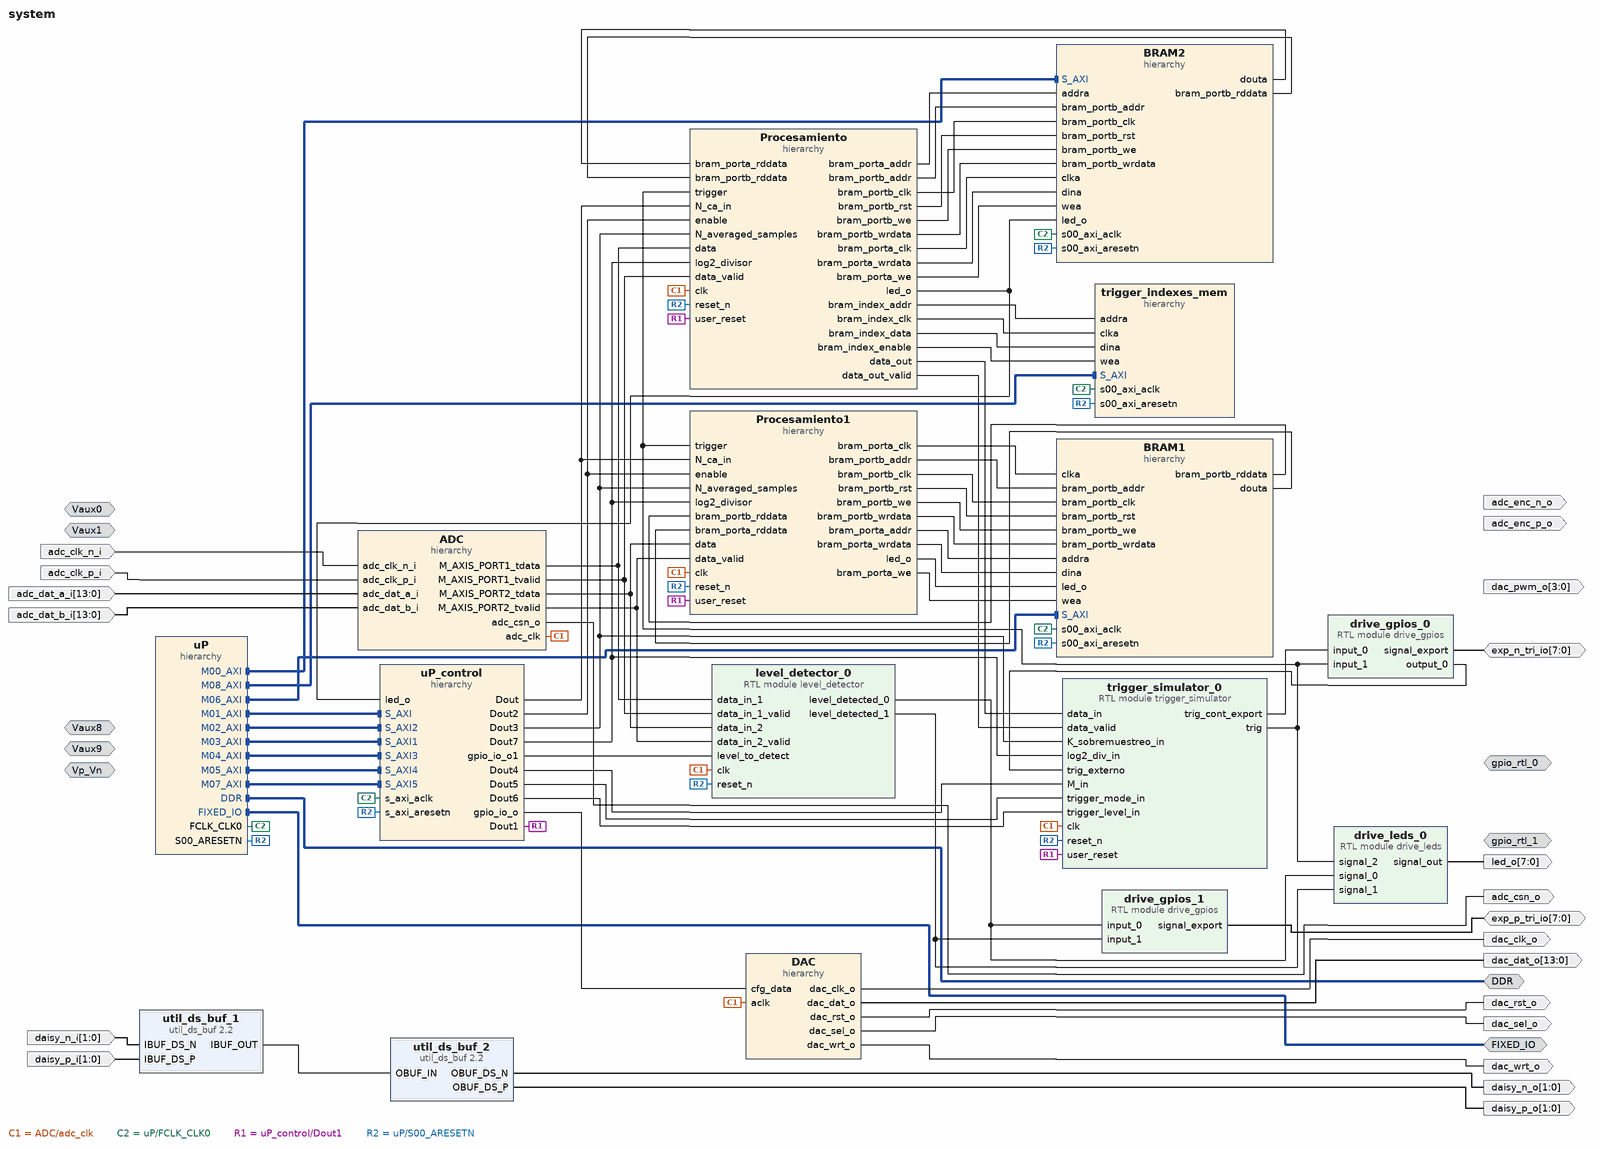
[diagram p0: block diagram of the top level]
# Vivado block design system, xc7z010clg400-1, Vivado 2022.2
create_bd_design system

create_bd_intf_port -mode Slave -vlnv xilinx.com:interface:diff_analog_io_rtl:1.0 Vp_Vn
create_bd_intf_port -mode Slave -vlnv xilinx.com:interface:diff_analog_io_rtl:1.0 Vaux0
create_bd_intf_port -mode Slave -vlnv xilinx.com:interface:diff_analog_io_rtl:1.0 Vaux1
create_bd_intf_port -mode Slave -vlnv xilinx.com:interface:diff_analog_io_rtl:1.0 Vaux9
create_bd_intf_port -mode Slave -vlnv xilinx.com:interface:diff_analog_io_rtl:1.0 Vaux8
create_bd_intf_port -mode Master -vlnv xilinx.com:interface:ddrx_rtl:1.0 DDR
create_bd_intf_port -mode Master -vlnv xilinx.com:display_processing_system7:fixedio_rtl:1.0 FIXED_IO
create_bd_intf_port -mode Master -vlnv xilinx.com:interface:gpio_rtl:1.0 gpio_rtl_0
create_bd_intf_port -mode Master -vlnv xilinx.com:interface:gpio_rtl:1.0 gpio_rtl_1
create_bd_port -dir I -from 13 -to 0 adc_dat_a_i
create_bd_port -dir I -from 13 -to 0 adc_dat_b_i
create_bd_port -dir I adc_clk_p_i
create_bd_port -dir I adc_clk_n_i
create_bd_port -dir O adc_enc_p_o
create_bd_port -dir O adc_enc_n_o
create_bd_port -dir O adc_csn_o
create_bd_port -dir O -from 13 -to 0 dac_dat_o
create_bd_port -dir O dac_clk_o
create_bd_port -dir O dac_rst_o
create_bd_port -dir O dac_sel_o
create_bd_port -dir O dac_wrt_o
create_bd_port -dir O -from 3 -to 0 dac_pwm_o
create_bd_port -dir IO -from 7 -to 0 exp_p_tri_io
create_bd_port -dir IO -from 7 -to 0 exp_n_tri_io
create_bd_port -dir O -from 1 -to 0 daisy_p_o
create_bd_port -dir O -from 1 -to 0 daisy_n_o
create_bd_port -dir I -from 1 -to 0 daisy_p_i
create_bd_port -dir I -from 1 -to 0 daisy_n_i
create_bd_port -dir O -from 7 -to 0 led_o

create_bd_cell -type ip -vlnv xilinx.com:ip:util_ds_buf:2.2 util_ds_buf_1
set_property -dict {CONFIG.C_SIZE 2} [get_bd_cells util_ds_buf_1]
create_bd_cell -type ip -vlnv xilinx.com:ip:util_ds_buf:2.2 util_ds_buf_2
set_property -dict {CONFIG.C_BUF_TYPE OBUFDS CONFIG.C_SIZE 2} [get_bd_cells util_ds_buf_2]
create_bd_cell -type hier DAC
create_bd_cell -type hier uP_control
create_bd_cell -type hier uP
create_bd_cell -type hier ADC
create_bd_cell -type hier Procesamiento
create_bd_cell -type hier Procesamiento1
create_bd_cell -type hier BRAM1
create_bd_cell -type hier BRAM2
create_bd_cell -type module -reference trigger_simulator trigger_simulator_0
create_bd_cell -type hier trigger_indexes_mem
create_bd_cell -type module -reference drive_gpios drive_gpios_1
create_bd_cell -type module -reference level_detector level_detector_0
create_bd_cell -type module -reference drive_leds drive_leds_0
create_bd_cell -type module -reference drive_gpios drive_gpios_0

# ---- hierarchy /DAC ----
current_bd_instance /DAC
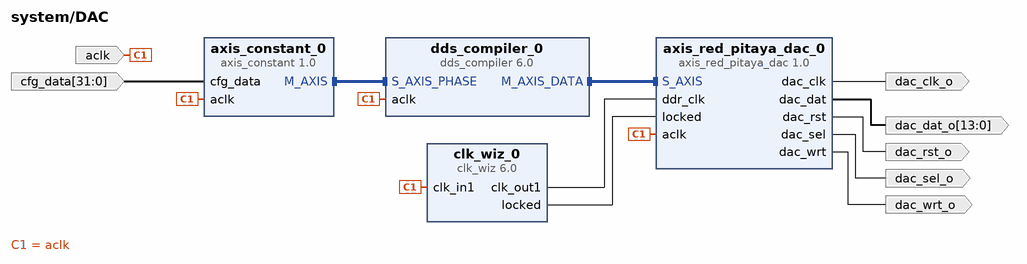
[diagram p1: block diagram inside /DAC]
create_bd_pin -dir I -type clk aclk
create_bd_pin -dir O -type clk dac_clk_o
create_bd_pin -dir O -type rst dac_rst_o
create_bd_pin -dir O dac_sel_o
create_bd_pin -dir O dac_wrt_o
create_bd_pin -dir O -from 13 -to 0 dac_dat_o
create_bd_pin -dir I -from 31 -to 0 cfg_data

create_bd_cell -type ip -vlnv pavel-demin:user:axis_red_pitaya_dac:1.0 axis_red_pitaya_dac_0
create_bd_cell -type ip -vlnv xilinx.com:ip:dds_compiler:6.0 dds_compiler_0
set_property -dict [list \
  CONFIG.Amplitude_Mode Unit_Circle \
  CONFIG.DATA_Has_TLAST Not_Required \
  CONFIG.DDS_Clock_Rate 125 \
  CONFIG.Frequency_Resolution 0.5 \
  CONFIG.Has_Phase_Out false \
  CONFIG.Latency 8 \
  CONFIG.M_DATA_Has_TUSER Not_Required \
  CONFIG.Negative_Cosine false \
  CONFIG.Noise_Shaping Auto \
  CONFIG.Output_Frequency1 0 \
  CONFIG.Output_Width 14 \
  CONFIG.PINC1 0 \
  CONFIG.Phase_Increment Streaming \
  CONFIG.Phase_Width 28 \
  CONFIG.S_PHASE_Has_TUSER Not_Required \
  CONFIG.Spurious_Free_Dynamic_Range 84 \
] [get_bd_cells dds_compiler_0]
create_bd_cell -type ip -vlnv xilinx.com:ip:clk_wiz:6.0 clk_wiz_0
set_property -dict [list \
  CONFIG.CLKIN1_JITTER_PS 80.0 \
  CONFIG.CLKOUT1_JITTER 104.759 \
  CONFIG.CLKOUT1_PHASE_ERROR 96.948 \
  CONFIG.CLKOUT1_REQUESTED_OUT_FREQ 250.000 \
  CONFIG.MMCM_CLKFBOUT_MULT_F 8.000 \
  CONFIG.MMCM_CLKIN1_PERIOD 8.000 \
  CONFIG.MMCM_CLKOUT0_DIVIDE_F 4.000 \
  CONFIG.PRIM_IN_FREQ 125.000 \
  CONFIG.USE_RESET false \
] [get_bd_cells clk_wiz_0]
create_bd_cell -type ip -vlnv pavel-demin:user:axis_constant:1.0 axis_constant_0

# ---- hierarchy /uP_control ----
current_bd_instance /uP_control
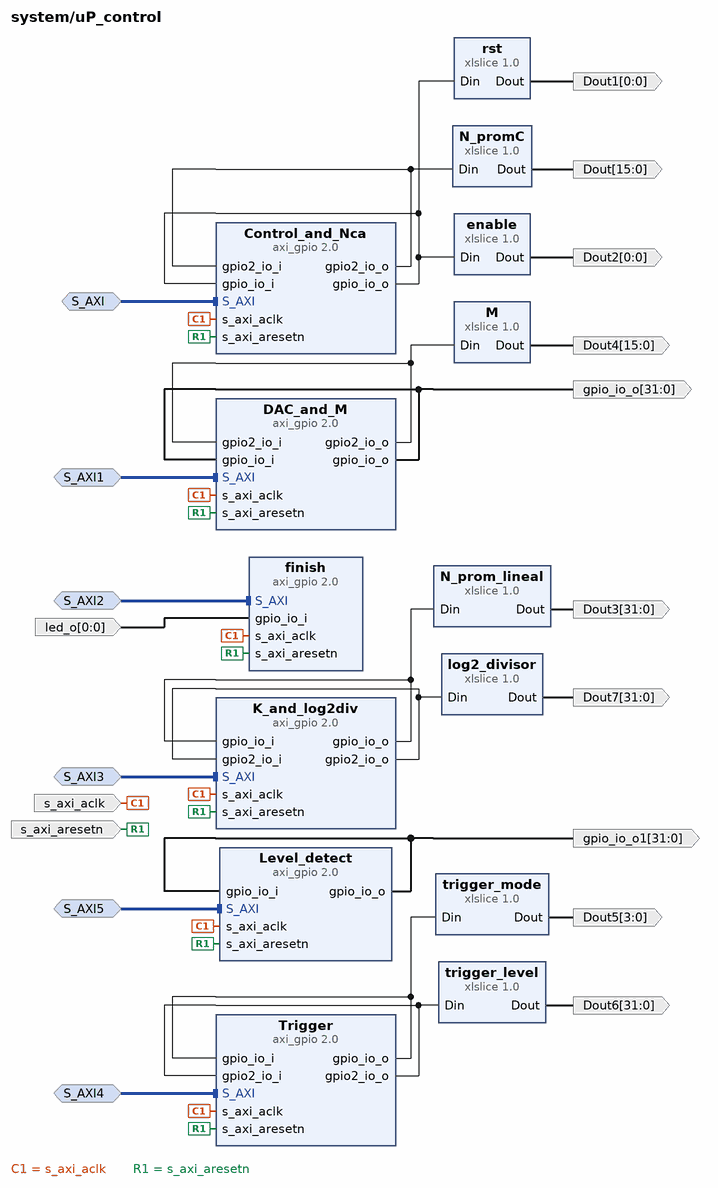
[diagram p2: block diagram inside /uP_control]
create_bd_intf_pin -mode Slave -vlnv xilinx.com:interface:aximm_rtl:1.0 S_AXI
create_bd_intf_pin -mode Slave -vlnv xilinx.com:interface:aximm_rtl:1.0 S_AXI2
create_bd_intf_pin -mode Slave -vlnv xilinx.com:interface:aximm_rtl:1.0 S_AXI3
create_bd_intf_pin -mode Slave -vlnv xilinx.com:interface:aximm_rtl:1.0 S_AXI1
create_bd_intf_pin -mode Slave -vlnv xilinx.com:interface:aximm_rtl:1.0 S_AXI4
create_bd_intf_pin -mode Slave -vlnv xilinx.com:interface:aximm_rtl:1.0 S_AXI5
create_bd_pin -dir O -from 15 -to 0 Dout
create_bd_pin -dir O -from 0 -to 0 Dout1
create_bd_pin -dir O -from 0 -to 0 Dout2
create_bd_pin -dir I -type clk s_axi_aclk
create_bd_pin -dir I -type rst s_axi_aresetn
create_bd_pin -dir I -from 0 -to 0 led_o
create_bd_pin -dir O -from 15 -to 0 Dout4
create_bd_pin -dir O -from 31 -to 0 Dout3
create_bd_pin -dir O -from 31 -to 0 gpio_io_o
create_bd_pin -dir O -from 3 -to 0 Dout5
create_bd_pin -dir O -from 31 -to 0 Dout6
create_bd_pin -dir O -from 31 -to 0 Dout7
create_bd_pin -dir O -from 31 -to 0 gpio_io_o1

create_bd_cell -type ip -vlnv xilinx.com:ip:xlslice:1.0 N_promC
set_property -dict {CONFIG.DIN_FROM 15} [get_bd_cells N_promC]
create_bd_cell -type ip -vlnv xilinx.com:ip:xlslice:1.0 rst
set_property -dict {CONFIG.DIN_FROM 1 CONFIG.DIN_TO 1} [get_bd_cells rst]
create_bd_cell -type ip -vlnv xilinx.com:ip:xlslice:1.0 enable
create_bd_cell -type ip -vlnv xilinx.com:ip:axi_gpio:2.0 Control_and_Nca
set_property -dict {CONFIG.C_ALL_INPUTS 0 CONFIG.C_ALL_OUTPUTS 0 CONFIG.C_IS_DUAL 1} [get_bd_cells Control_and_Nca]
create_bd_cell -type ip -vlnv xilinx.com:ip:axi_gpio:2.0 finish
set_property -dict {CONFIG.C_ALL_INPUTS 1 CONFIG.C_GPIO_WIDTH 1} [get_bd_cells finish]
create_bd_cell -type ip -vlnv xilinx.com:ip:xlslice:1.0 M
set_property -dict {CONFIG.DIN_FROM 15} [get_bd_cells M]
create_bd_cell -type ip -vlnv xilinx.com:ip:xlslice:1.0 N_prom_lineal
set_property -dict {CONFIG.DIN_FROM 31 CONFIG.DIN_TO 0 CONFIG.DOUT_WIDTH 32} [get_bd_cells N_prom_lineal]
create_bd_cell -type ip -vlnv xilinx.com:ip:axi_gpio:2.0 K_and_log2div
set_property -dict {CONFIG.C_ALL_INPUTS 0 CONFIG.C_ALL_OUTPUTS 0 CONFIG.C_IS_DUAL 1} [get_bd_cells K_and_log2div]
create_bd_cell -type ip -vlnv xilinx.com:ip:axi_gpio:2.0 DAC_and_M
set_property -dict {CONFIG.C_ALL_INPUTS 0 CONFIG.C_ALL_OUTPUTS 0 CONFIG.C_IS_DUAL 1} [get_bd_cells DAC_and_M]
create_bd_cell -type ip -vlnv xilinx.com:ip:axi_gpio:2.0 Trigger
set_property -dict {CONFIG.C_ALL_INPUTS 0 CONFIG.C_ALL_OUTPUTS 0 CONFIG.C_IS_DUAL 1} [get_bd_cells Trigger]
create_bd_cell -type ip -vlnv xilinx.com:ip:xlslice:1.0 trigger_mode
set_property -dict {CONFIG.DIN_FROM 3 CONFIG.DIN_WIDTH 32} [get_bd_cells trigger_mode]
create_bd_cell -type ip -vlnv xilinx.com:ip:xlslice:1.0 trigger_level
set_property -dict {CONFIG.DIN_FROM 31 CONFIG.DIN_TO 0 CONFIG.DIN_WIDTH 32} [get_bd_cells trigger_level]
create_bd_cell -type ip -vlnv xilinx.com:ip:xlslice:1.0 log2_divisor
set_property -dict {CONFIG.DIN_FROM 31 CONFIG.DIN_TO 0 CONFIG.DOUT_WIDTH 32} [get_bd_cells log2_divisor]
create_bd_cell -type ip -vlnv xilinx.com:ip:axi_gpio:2.0 Level_detect
set_property -dict {CONFIG.C_ALL_INPUTS 0 CONFIG.C_ALL_OUTPUTS 0 CONFIG.C_IS_DUAL 1} [get_bd_cells Level_detect]

# ---- hierarchy /uP ----
current_bd_instance /uP
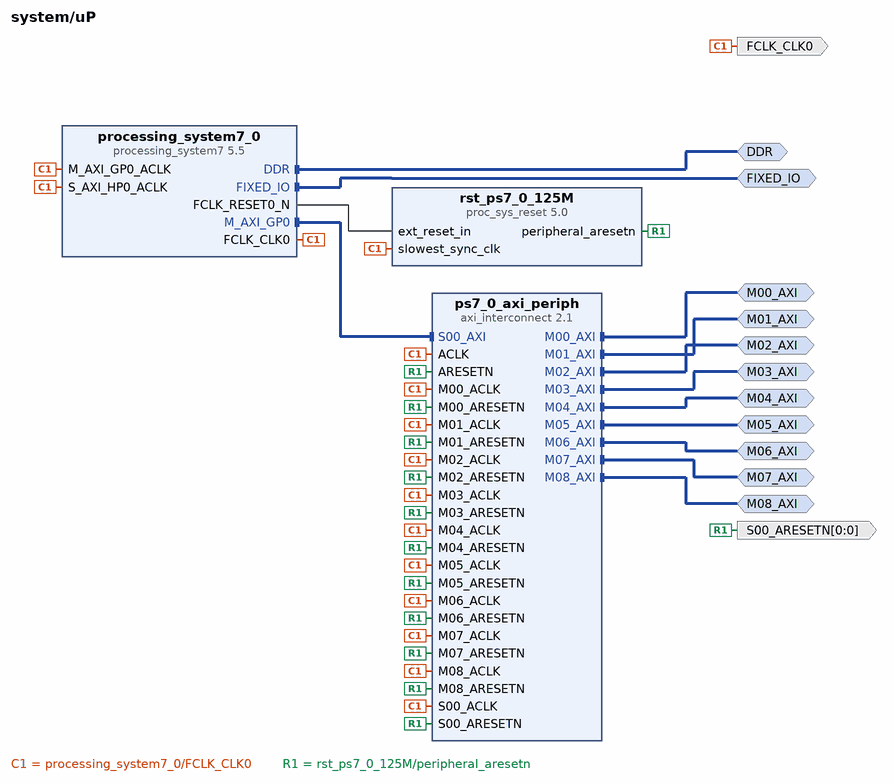
[diagram p3: block diagram inside /uP]
create_bd_intf_pin -mode Master -vlnv xilinx.com:interface:ddrx_rtl:1.0 DDR
create_bd_intf_pin -mode Master -vlnv xilinx.com:display_processing_system7:fixedio_rtl:1.0 FIXED_IO
create_bd_intf_pin -mode Master -vlnv xilinx.com:interface:aximm_rtl:1.0 M00_AXI
create_bd_intf_pin -mode Master -vlnv xilinx.com:interface:aximm_rtl:1.0 M01_AXI
create_bd_intf_pin -mode Master -vlnv xilinx.com:interface:aximm_rtl:1.0 M02_AXI
create_bd_intf_pin -mode Master -vlnv xilinx.com:interface:aximm_rtl:1.0 M03_AXI
create_bd_intf_pin -mode Master -vlnv xilinx.com:interface:aximm_rtl:1.0 M04_AXI
create_bd_intf_pin -mode Master -vlnv xilinx.com:interface:aximm_rtl:1.0 M05_AXI
create_bd_intf_pin -mode Master -vlnv xilinx.com:interface:aximm_rtl:1.0 M06_AXI
create_bd_intf_pin -mode Master -vlnv xilinx.com:interface:aximm_rtl:1.0 M07_AXI
create_bd_intf_pin -mode Master -vlnv xilinx.com:interface:aximm_rtl:1.0 M08_AXI
create_bd_pin -dir O -type clk FCLK_CLK0
create_bd_pin -dir O -from 0 -to 0 -type rst S00_ARESETN

create_bd_cell -type ip -vlnv xilinx.com:ip:processing_system7:5.5 processing_system7_0
set_property -dict [list \
  CONFIG.PCW_APU_PERIPHERAL_FREQMHZ 666.666666 \
  CONFIG.PCW_ENET0_ENET0_IO {MIO 16 .. 27} \
  CONFIG.PCW_ENET0_GRP_MDIO_ENABLE 1 \
  CONFIG.PCW_ENET0_GRP_MDIO_IO EMIO \
  CONFIG.PCW_ENET0_PERIPHERAL_ENABLE 1 \
  CONFIG.PCW_ENET0_RESET_ENABLE 0 \
  CONFIG.PCW_ENET_RESET_ENABLE 1 \
  CONFIG.PCW_ENET_RESET_SELECT {Share reset pin} \
  CONFIG.PCW_FPGA0_PERIPHERAL_FREQMHZ 125 \
  CONFIG.PCW_FPGA1_PERIPHERAL_FREQMHZ 250 \
  CONFIG.PCW_FPGA3_PERIPHERAL_FREQMHZ 200 \
  CONFIG.PCW_GPIO_MIO_GPIO_ENABLE 1 \
  CONFIG.PCW_GPIO_MIO_GPIO_IO MIO \
  CONFIG.PCW_GPIO_PERIPHERAL_ENABLE 1 \
  CONFIG.PCW_I2C0_GRP_INT_ENABLE 0 \
  CONFIG.PCW_I2C0_I2C0_IO {MIO 50 .. 51} \
  CONFIG.PCW_I2C0_PERIPHERAL_ENABLE 1 \
  CONFIG.PCW_I2C_PERIPHERAL_FREQMHZ 111.111115 \
  CONFIG.PCW_I2C_RESET_ENABLE 1 \
  CONFIG.PCW_I2C_RESET_SELECT {Share reset pin} \
  CONFIG.PCW_IMPORT_BOARD_PRESET cfg/red_pitaya.xml \
  CONFIG.PCW_PRESET_BANK1_VOLTAGE {LVCMOS 2.5V} \
  CONFIG.PCW_QSPI_GRP_SINGLE_SS_ENABLE 1 \
  CONFIG.PCW_QSPI_GRP_SINGLE_SS_IO {MIO 1 .. 6} \
  CONFIG.PCW_QSPI_PERIPHERAL_ENABLE 1 \
  CONFIG.PCW_QSPI_PERIPHERAL_FREQMHZ 125 \
  CONFIG.PCW_QSPI_QSPI_IO {MIO 1 .. 6} \
  CONFIG.PCW_SD0_GRP_CD_ENABLE 1 \
  CONFIG.PCW_SD0_GRP_CD_IO {MIO 46} \
  CONFIG.PCW_SD0_GRP_WP_ENABLE 1 \
  CONFIG.PCW_SD0_GRP_WP_IO {MIO 47} \
  CONFIG.PCW_SD0_PERIPHERAL_ENABLE 1 \
  CONFIG.PCW_SD0_SD0_IO {MIO 40 .. 45} \
  CONFIG.PCW_SDIO_PERIPHERAL_FREQMHZ 100 \
  CONFIG.PCW_SINGLE_QSPI_DATA_MODE x4 \
  CONFIG.PCW_SPI0_PERIPHERAL_ENABLE 1 \
  CONFIG.PCW_SPI0_SPI0_IO EMIO \
  CONFIG.PCW_SPI1_PERIPHERAL_ENABLE 1 \
  CONFIG.PCW_SPI1_SPI1_IO {MIO 10 .. 15} \
  CONFIG.PCW_TTC0_PERIPHERAL_ENABLE 1 \
  CONFIG.PCW_TTC0_TTC0_IO EMIO \
  CONFIG.PCW_UART0_PERIPHERAL_ENABLE 1 \
  CONFIG.PCW_UART0_UART0_IO {MIO 14 .. 15} \
  CONFIG.PCW_UART1_PERIPHERAL_ENABLE 1 \
  CONFIG.PCW_UART1_UART1_IO {MIO 8 .. 9} \
  CONFIG.PCW_UART_PERIPHERAL_FREQMHZ 100 \
  CONFIG.PCW_UIPARAM_DDR_BUS_WIDTH {16 Bit} \
  CONFIG.PCW_UIPARAM_DDR_FREQ_MHZ 533.333333 \
  CONFIG.PCW_UIPARAM_DDR_PARTNO {MT41J256M16 RE-125} \
  CONFIG.PCW_USB0_PERIPHERAL_ENABLE 1 \
  CONFIG.PCW_USB0_RESET_ENABLE 1 \
  CONFIG.PCW_USB0_RESET_IO {MIO 48} \
  CONFIG.PCW_USB0_USB0_IO {MIO 28 .. 39} \
  CONFIG.PCW_USB_RESET_ENABLE 1 \
  CONFIG.PCW_USB_RESET_SELECT {Share reset pin} \
  CONFIG.PCW_USE_S_AXI_HP0 1 \
] [get_bd_cells processing_system7_0]
# 429 more settings of processing_system7_0 are not shown: defaults, MIO pin electricals, DDR timing, and values the tool derives
create_bd_cell -type ip -vlnv xilinx.com:ip:proc_sys_reset:5.0 rst_ps7_0_125M
create_bd_cell -type ip -vlnv xilinx.com:ip:axi_interconnect:2.1 ps7_0_axi_periph
set_property -dict {CONFIG.NUM_MI 9} [get_bd_cells ps7_0_axi_periph]

# ---- hierarchy /ADC ----
current_bd_instance /ADC
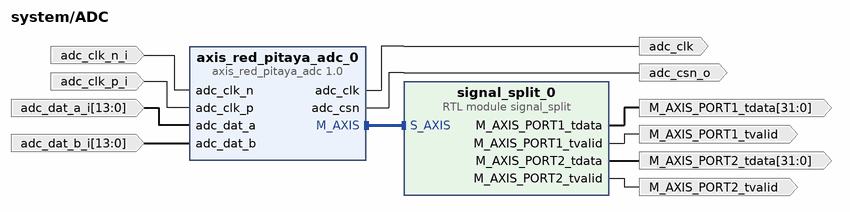
[diagram p4: block diagram inside /ADC]
create_bd_pin -dir O -from 31 -to 0 M_AXIS_PORT1_tdata
create_bd_pin -dir O M_AXIS_PORT1_tvalid
create_bd_pin -dir O -type clk adc_clk
create_bd_pin -dir O adc_csn_o
create_bd_pin -dir I adc_clk_p_i
create_bd_pin -dir I adc_clk_n_i
create_bd_pin -dir I -from 13 -to 0 adc_dat_a_i
create_bd_pin -dir I -from 13 -to 0 adc_dat_b_i
create_bd_pin -dir O -from 31 -to 0 M_AXIS_PORT2_tdata
create_bd_pin -dir O M_AXIS_PORT2_tvalid

create_bd_cell -type ip -vlnv pavel-demin:user:axis_red_pitaya_adc:1.0 axis_red_pitaya_adc_0
create_bd_cell -type module -reference signal_split signal_split_0

# ---- hierarchy /Procesamiento ----
current_bd_instance /Procesamiento
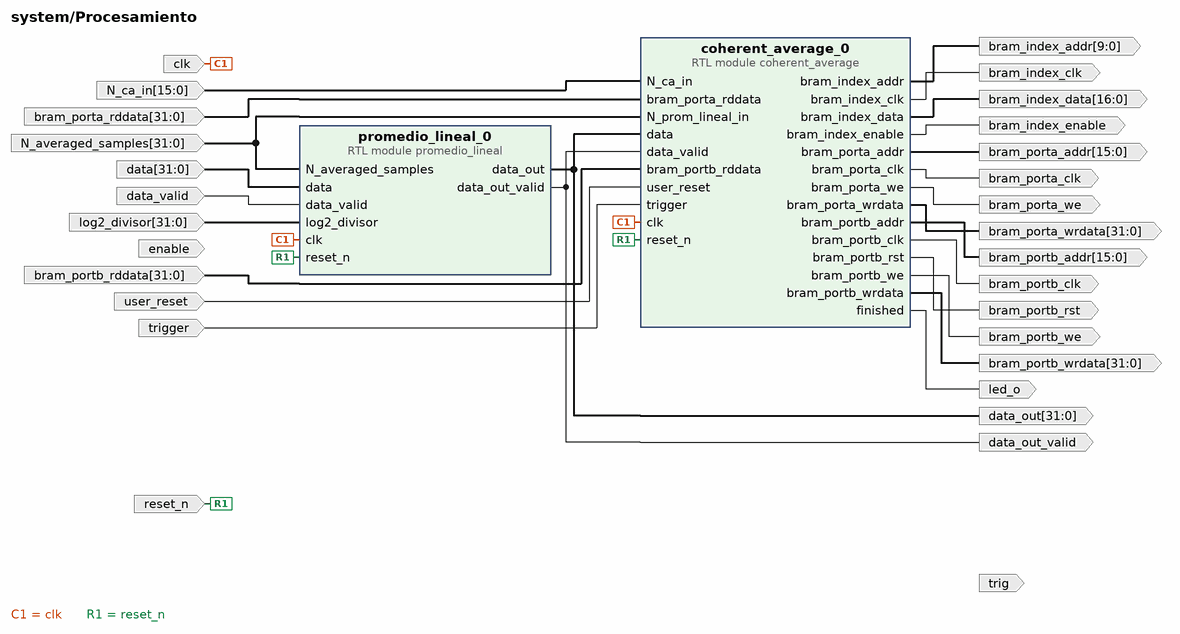
[diagram p5: block diagram inside /Procesamiento]
create_bd_pin -dir I -type clk clk
create_bd_pin -dir I -type rst reset_n
create_bd_pin -dir I -type rst user_reset
create_bd_pin -dir I enable
create_bd_pin -dir I -from 31 -to 0 N_averaged_samples
create_bd_pin -dir I data_valid
create_bd_pin -dir I -from 31 -to 0 data
create_bd_pin -dir O bram_portb_we
create_bd_pin -dir I -from 31 -to 0 bram_portb_rddata
create_bd_pin -dir O -from 31 -to 0 bram_portb_wrdata
create_bd_pin -dir O -from 15 -to 0 bram_portb_addr
create_bd_pin -dir O -type rst bram_portb_rst
create_bd_pin -dir O -type clk bram_portb_clk
create_bd_pin -dir O bram_porta_we
create_bd_pin -dir I -from 31 -to 0 bram_porta_rddata
create_bd_pin -dir O -from 31 -to 0 bram_porta_wrdata
create_bd_pin -dir O -from 15 -to 0 bram_porta_addr
create_bd_pin -dir O -type clk bram_porta_clk
create_bd_pin -dir I -from 15 -to 0 N_ca_in
create_bd_pin -dir O led_o
create_bd_pin -dir I -from 31 -to 0 log2_divisor
create_bd_pin -dir O trig
create_bd_pin -dir O data_out_valid
create_bd_pin -dir O -from 31 -to 0 data_out
create_bd_pin -dir I trigger
create_bd_pin -dir O -from 9 -to 0 bram_index_addr
create_bd_pin -dir O -type clk bram_index_clk
create_bd_pin -dir O bram_index_enable
create_bd_pin -dir O -from 16 -to 0 bram_index_data

create_bd_cell -type module -reference promedio_lineal promedio_lineal_0
create_bd_cell -type module -reference coherent_average coherent_average_0

# ---- hierarchy /Procesamiento1 ----
current_bd_instance /Procesamiento1
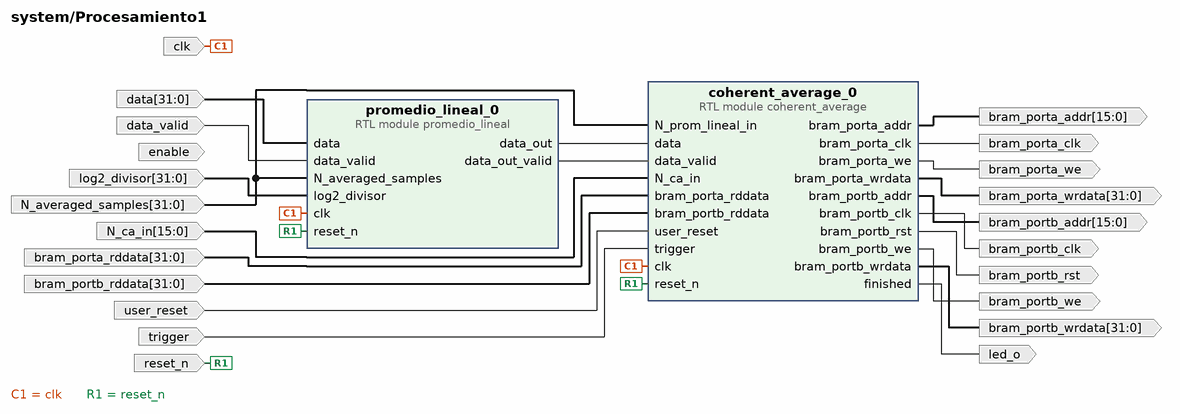
[diagram p6: block diagram inside /Procesamiento1]
create_bd_pin -dir I -type clk clk
create_bd_pin -dir I -type rst reset_n
create_bd_pin -dir I -type rst user_reset
create_bd_pin -dir I enable
create_bd_pin -dir I -from 31 -to 0 N_averaged_samples
create_bd_pin -dir I data_valid
create_bd_pin -dir I -from 31 -to 0 data
create_bd_pin -dir O bram_portb_we
create_bd_pin -dir I -from 31 -to 0 bram_portb_rddata
create_bd_pin -dir O -from 31 -to 0 bram_portb_wrdata
create_bd_pin -dir O -from 15 -to 0 bram_portb_addr
create_bd_pin -dir O -type rst bram_portb_rst
create_bd_pin -dir O -type clk bram_portb_clk
create_bd_pin -dir O bram_porta_we
create_bd_pin -dir I -from 31 -to 0 bram_porta_rddata
create_bd_pin -dir O -from 31 -to 0 bram_porta_wrdata
create_bd_pin -dir O -from 15 -to 0 bram_porta_addr
create_bd_pin -dir O -type clk bram_porta_clk
create_bd_pin -dir I -from 15 -to 0 N_ca_in
create_bd_pin -dir O led_o
create_bd_pin -dir I -from 31 -to 0 log2_divisor
create_bd_pin -dir I trigger

create_bd_cell -type module -reference promedio_lineal promedio_lineal_0
create_bd_cell -type module -reference coherent_average coherent_average_0

# ---- hierarchy /BRAM1 ----
current_bd_instance /BRAM1
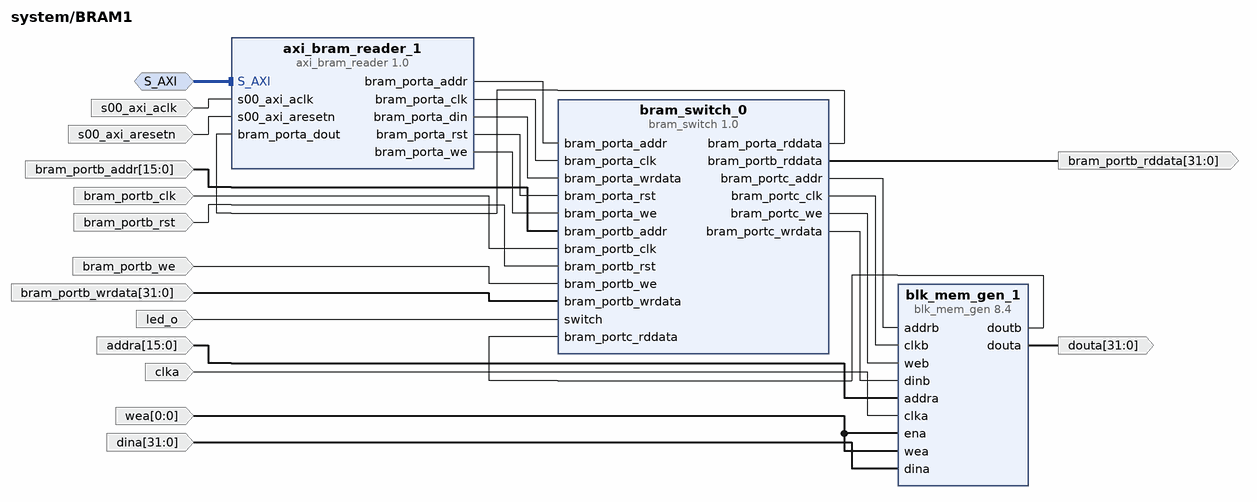
[diagram p7: block diagram inside /BRAM1]
create_bd_intf_pin -mode Slave -vlnv xilinx.com:interface:aximm_rtl:1.0 S_AXI
create_bd_pin -dir I -type clk s00_axi_aclk
create_bd_pin -dir I -type rst s00_axi_aresetn
create_bd_pin -dir I -type clk clka
create_bd_pin -dir I -from 0 -to 0 wea
create_bd_pin -dir I -from 15 -to 0 addra
create_bd_pin -dir I -from 31 -to 0 dina
create_bd_pin -dir O -from 31 -to 0 douta
create_bd_pin -dir I led_o
create_bd_pin -dir I -type clk bram_portb_clk
create_bd_pin -dir I -type rst bram_portb_rst
create_bd_pin -dir I -from 15 -to 0 bram_portb_addr
create_bd_pin -dir I -from 31 -to 0 bram_portb_wrdata
create_bd_pin -dir O -from 31 -to 0 bram_portb_rddata
create_bd_pin -dir I bram_portb_we

create_bd_cell -type ip -vlnv anton-potocnik:user:axi_bram_reader:1.0 axi_bram_reader_1
set_property -dict {CONFIG.BRAM_ADDR_WIDTH 16 CONFIG.C_S00_AXI_ADDR_WIDTH 18} [get_bd_cells axi_bram_reader_1]
create_bd_cell -type ip -vlnv xilinx.com:ip:blk_mem_gen:8.4 blk_mem_gen_1
set_property -dict [list \
  CONFIG.Algorithm Minimum_Area \
  CONFIG.Assume_Synchronous_Clk false \
  CONFIG.Enable_A Use_ENA_Pin \
  CONFIG.Enable_B Always_Enabled \
  CONFIG.Fill_Remaining_Memory_Locations true \
  CONFIG.Memory_Type True_Dual_Port_RAM \
  CONFIG.Operating_Mode_A READ_FIRST \
  CONFIG.Operating_Mode_B READ_FIRST \
  CONFIG.Register_PortA_Output_of_Memory_Primitives false \
  CONFIG.Register_PortB_Output_of_Memory_Primitives false \
  CONFIG.Use_Byte_Write_Enable false \
  CONFIG.Write_Depth_A 30720 \
  CONFIG.Write_Width_A 32 \
  CONFIG.use_bram_block Stand_Alone \
] [get_bd_cells blk_mem_gen_1]
create_bd_cell -type ip -vlnv xilinx.com:user:bram_switch:1.0 bram_switch_0

# ---- hierarchy /BRAM2 ----
current_bd_instance /BRAM2
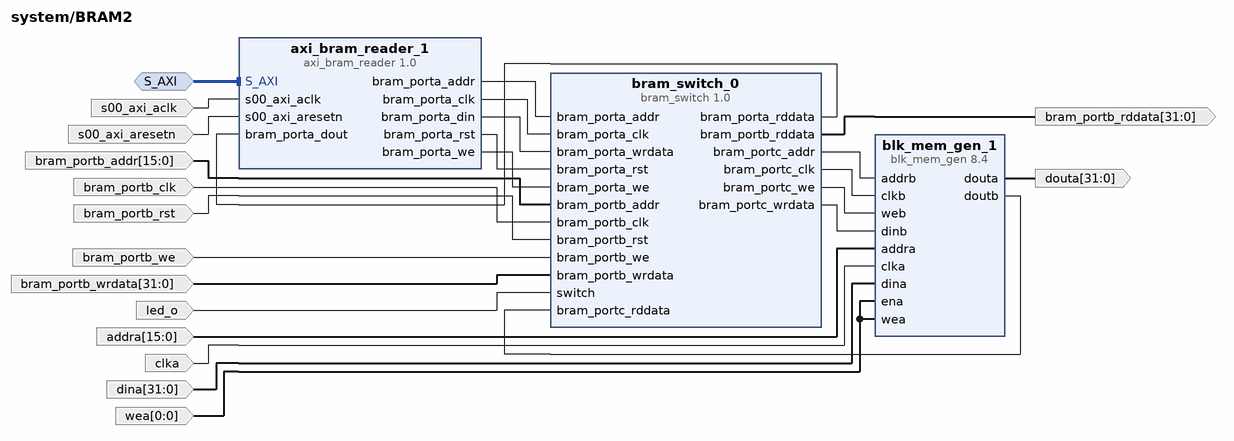
[diagram p8: block diagram inside /BRAM2]
create_bd_intf_pin -mode Slave -vlnv xilinx.com:interface:aximm_rtl:1.0 S_AXI
create_bd_pin -dir I -type clk s00_axi_aclk
create_bd_pin -dir I -type rst s00_axi_aresetn
create_bd_pin -dir I -type clk clka
create_bd_pin -dir I -from 0 -to 0 wea
create_bd_pin -dir I -from 15 -to 0 addra
create_bd_pin -dir I -from 31 -to 0 dina
create_bd_pin -dir O -from 31 -to 0 douta
create_bd_pin -dir I led_o
create_bd_pin -dir I -type clk bram_portb_clk
create_bd_pin -dir I -type rst bram_portb_rst
create_bd_pin -dir I -from 15 -to 0 bram_portb_addr
create_bd_pin -dir I -from 31 -to 0 bram_portb_wrdata
create_bd_pin -dir O -from 31 -to 0 bram_portb_rddata
create_bd_pin -dir I bram_portb_we

create_bd_cell -type ip -vlnv anton-potocnik:user:axi_bram_reader:1.0 axi_bram_reader_1
set_property -dict {CONFIG.BRAM_ADDR_WIDTH 16 CONFIG.C_S00_AXI_ADDR_WIDTH 18} [get_bd_cells axi_bram_reader_1]
create_bd_cell -type ip -vlnv xilinx.com:user:bram_switch:1.0 bram_switch_0
create_bd_cell -type ip -vlnv xilinx.com:ip:blk_mem_gen:8.4 blk_mem_gen_1
set_property -dict [list \
  CONFIG.Algorithm Minimum_Area \
  CONFIG.Assume_Synchronous_Clk false \
  CONFIG.Enable_A Use_ENA_Pin \
  CONFIG.Enable_B Always_Enabled \
  CONFIG.Fill_Remaining_Memory_Locations true \
  CONFIG.Memory_Type True_Dual_Port_RAM \
  CONFIG.Operating_Mode_A READ_FIRST \
  CONFIG.Operating_Mode_B READ_FIRST \
  CONFIG.Register_PortA_Output_of_Memory_Primitives false \
  CONFIG.Register_PortB_Output_of_Memory_Primitives false \
  CONFIG.Use_Byte_Write_Enable false \
  CONFIG.Write_Depth_A 30720 \
  CONFIG.Write_Width_A 32 \
  CONFIG.use_bram_block Stand_Alone \
] [get_bd_cells blk_mem_gen_1]

# ---- hierarchy /trigger_indexes_mem ----
current_bd_instance /trigger_indexes_mem
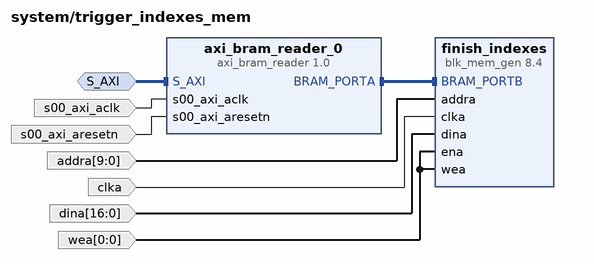
[diagram p9: block diagram inside /trigger_indexes_mem]
create_bd_intf_pin -mode Slave -vlnv xilinx.com:interface:aximm_rtl:1.0 S_AXI
create_bd_pin -dir I -type clk s00_axi_aclk
create_bd_pin -dir I -type rst s00_axi_aresetn
create_bd_pin -dir I -type clk clka
create_bd_pin -dir I -from 0 -to 0 wea
create_bd_pin -dir I -from 9 -to 0 addra
create_bd_pin -dir I -from 16 -to 0 dina

create_bd_cell -type ip -vlnv anton-potocnik:user:axi_bram_reader:1.0 axi_bram_reader_0
set_property -dict {CONFIG.BRAM_DATA_WIDTH 16 CONFIG.C_S00_AXI_DATA_WIDTH 32} [get_bd_cells axi_bram_reader_0]
create_bd_cell -type ip -vlnv xilinx.com:ip:blk_mem_gen:8.4 finish_indexes
set_property -dict [list \
  CONFIG.Memory_Type Simple_Dual_Port_RAM \
  CONFIG.Operating_Mode_A NO_CHANGE \
  CONFIG.Register_PortB_Output_of_Memory_Primitives true \
  CONFIG.Write_Depth_A 8192 \
  CONFIG.Write_Width_A 16 \
  CONFIG.Write_Width_B 16 \
  CONFIG.use_bram_block Stand_Alone \
] [get_bd_cells finish_indexes]

# ---- connections ----

current_bd_instance /DAC
connect_bd_intf_net [get_bd_intf_pins axis_constant_0/M_AXIS] [get_bd_intf_pins dds_compiler_0/S_AXIS_PHASE]
connect_bd_intf_net [get_bd_intf_pins dds_compiler_0/M_AXIS_DATA] [get_bd_intf_pins axis_red_pitaya_dac_0/S_AXIS]
connect_bd_net [get_bd_pins cfg_data] [get_bd_pins axis_constant_0/cfg_data]
connect_bd_net -net axis_red_pitaya_adc_0_adc_clk [get_bd_pins aclk] \
  [get_bd_pins axis_constant_0/aclk] [get_bd_pins clk_wiz_0/clk_in1] [get_bd_pins dds_compiler_0/aclk] \
  [get_bd_pins axis_red_pitaya_dac_0/aclk]
connect_bd_net [get_bd_pins axis_red_pitaya_dac_0/dac_clk] [get_bd_pins dac_clk_o]
connect_bd_net [get_bd_pins axis_red_pitaya_dac_0/dac_dat] [get_bd_pins dac_dat_o]
connect_bd_net [get_bd_pins axis_red_pitaya_dac_0/dac_rst] [get_bd_pins dac_rst_o]
connect_bd_net [get_bd_pins axis_red_pitaya_dac_0/dac_sel] [get_bd_pins dac_sel_o]
connect_bd_net [get_bd_pins axis_red_pitaya_dac_0/dac_wrt] [get_bd_pins dac_wrt_o]
connect_bd_net [get_bd_pins clk_wiz_0/clk_out1] [get_bd_pins axis_red_pitaya_dac_0/ddr_clk]
connect_bd_net [get_bd_pins clk_wiz_0/locked] [get_bd_pins axis_red_pitaya_dac_0/locked]

current_bd_instance /uP_control
connect_bd_intf_net -intf_net S_AXI3_1 [get_bd_intf_pins S_AXI3] [get_bd_intf_pins K_and_log2div/S_AXI]
connect_bd_intf_net -intf_net S_AXI4_1 [get_bd_intf_pins S_AXI4] [get_bd_intf_pins Trigger/S_AXI]
connect_bd_intf_net -intf_net S_AXI5_1 [get_bd_intf_pins S_AXI5] [get_bd_intf_pins Level_detect/S_AXI]
connect_bd_intf_net [get_bd_intf_pins S_AXI] [get_bd_intf_pins Control_and_Nca/S_AXI]
connect_bd_intf_net [get_bd_intf_pins S_AXI2] [get_bd_intf_pins finish/S_AXI]
connect_bd_intf_net [get_bd_intf_pins S_AXI1] [get_bd_intf_pins DAC_and_M/S_AXI]
connect_bd_net [get_bd_pins Level_detect/gpio_io_o] [get_bd_pins gpio_io_o1] [get_bd_pins Level_detect/gpio_io_i]
connect_bd_net [get_bd_pins M/Dout] [get_bd_pins Dout4]
connect_bd_net [get_bd_pins N_prom_lineal/Dout] [get_bd_pins Dout3]
connect_bd_net [get_bd_pins Control_and_Nca/gpio_io_o] [get_bd_pins Control_and_Nca/gpio_io_i] [get_bd_pins rst/Din] [get_bd_pins enable/Din]
connect_bd_net [get_bd_pins DAC_and_M/gpio_io_o] [get_bd_pins gpio_io_o] [get_bd_pins DAC_and_M/gpio_io_i]
connect_bd_net [get_bd_pins Control_and_Nca/gpio2_io_o] [get_bd_pins Control_and_Nca/gpio2_io_i] [get_bd_pins N_promC/Din]
connect_bd_net [get_bd_pins DAC_and_M/gpio2_io_o] [get_bd_pins M/Din] [get_bd_pins DAC_and_M/gpio2_io_i]
connect_bd_net [get_bd_pins K_and_log2div/gpio_io_o] [get_bd_pins K_and_log2div/gpio_io_i] [get_bd_pins N_prom_lineal/Din]
connect_bd_net [get_bd_pins Trigger/gpio2_io_o] [get_bd_pins Trigger/gpio2_io_i] [get_bd_pins trigger_level/Din]
connect_bd_net [get_bd_pins K_and_log2div/gpio2_io_o] [get_bd_pins K_and_log2div/gpio2_io_i] [get_bd_pins log2_divisor/Din]
connect_bd_net [get_bd_pins Trigger/gpio_io_o] [get_bd_pins trigger_mode/Din] [get_bd_pins Trigger/gpio_io_i]
connect_bd_net -net coherent_average_0_finished [get_bd_pins led_o] [get_bd_pins finish/gpio_io_i]
connect_bd_net [get_bd_pins log2_divisor/Dout] [get_bd_pins Dout7]
connect_bd_net -net processing_system7_0_FCLK_CLK0 [get_bd_pins s_axi_aclk] \
  [get_bd_pins finish/s_axi_aclk] [get_bd_pins Control_and_Nca/s_axi_aclk] [get_bd_pins K_and_log2div/s_axi_aclk] \
  [get_bd_pins DAC_and_M/s_axi_aclk] [get_bd_pins Trigger/s_axi_aclk] [get_bd_pins Level_detect/s_axi_aclk]
connect_bd_net [get_bd_pins rst/Dout] [get_bd_pins Dout1]
connect_bd_net -net rst_ps7_0_125M_peripheral_aresetn [get_bd_pins s_axi_aresetn] \
  [get_bd_pins finish/s_axi_aresetn] [get_bd_pins Control_and_Nca/s_axi_aresetn] [get_bd_pins K_and_log2div/s_axi_aresetn] \
  [get_bd_pins DAC_and_M/s_axi_aresetn] [get_bd_pins Trigger/s_axi_aresetn] [get_bd_pins Level_detect/s_axi_aresetn]
connect_bd_net -net trig_Dout [get_bd_pins enable/Dout] [get_bd_pins Dout2]
connect_bd_net [get_bd_pins trigger_level/Dout] [get_bd_pins Dout6]
connect_bd_net [get_bd_pins trigger_mode/Dout] [get_bd_pins Dout5]
connect_bd_net -net xlslice_0_Dout [get_bd_pins N_promC/Dout] [get_bd_pins Dout]

current_bd_instance /uP
connect_bd_intf_net [get_bd_intf_pins M06_AXI] [get_bd_intf_pins ps7_0_axi_periph/M06_AXI]
connect_bd_intf_net [get_bd_intf_pins M08_AXI] [get_bd_intf_pins ps7_0_axi_periph/M08_AXI]
connect_bd_intf_net [get_bd_intf_pins DDR] [get_bd_intf_pins processing_system7_0/DDR]
connect_bd_intf_net [get_bd_intf_pins FIXED_IO] [get_bd_intf_pins processing_system7_0/FIXED_IO]
connect_bd_intf_net [get_bd_intf_pins processing_system7_0/M_AXI_GP0] [get_bd_intf_pins ps7_0_axi_periph/S00_AXI]
connect_bd_intf_net [get_bd_intf_pins M00_AXI] [get_bd_intf_pins ps7_0_axi_periph/M00_AXI]
connect_bd_intf_net [get_bd_intf_pins M01_AXI] [get_bd_intf_pins ps7_0_axi_periph/M01_AXI]
connect_bd_intf_net [get_bd_intf_pins M02_AXI] [get_bd_intf_pins ps7_0_axi_periph/M02_AXI]
connect_bd_intf_net [get_bd_intf_pins M03_AXI] [get_bd_intf_pins ps7_0_axi_periph/M03_AXI]
connect_bd_intf_net [get_bd_intf_pins M04_AXI] [get_bd_intf_pins ps7_0_axi_periph/M04_AXI]
connect_bd_intf_net [get_bd_intf_pins M05_AXI] [get_bd_intf_pins ps7_0_axi_periph/M05_AXI]
connect_bd_intf_net [get_bd_intf_pins M07_AXI] [get_bd_intf_pins ps7_0_axi_periph/M07_AXI]
connect_bd_net [get_bd_pins processing_system7_0/FCLK_CLK0] \
  [get_bd_pins FCLK_CLK0] [get_bd_pins ps7_0_axi_periph/M01_ACLK] [get_bd_pins ps7_0_axi_periph/S00_ACLK] \
  [get_bd_pins ps7_0_axi_periph/ACLK] [get_bd_pins rst_ps7_0_125M/slowest_sync_clk] \
  [get_bd_pins processing_system7_0/S_AXI_HP0_ACLK] [get_bd_pins ps7_0_axi_periph/M00_ACLK] \
  [get_bd_pins ps7_0_axi_periph/M02_ACLK] [get_bd_pins ps7_0_axi_periph/M03_ACLK] \
  [get_bd_pins processing_system7_0/M_AXI_GP0_ACLK] [get_bd_pins ps7_0_axi_periph/M04_ACLK] \
  [get_bd_pins ps7_0_axi_periph/M05_ACLK] [get_bd_pins ps7_0_axi_periph/M06_ACLK] [get_bd_pins ps7_0_axi_periph/M07_ACLK] \
  [get_bd_pins ps7_0_axi_periph/M08_ACLK]
connect_bd_net [get_bd_pins processing_system7_0/FCLK_RESET0_N] [get_bd_pins rst_ps7_0_125M/ext_reset_in]
connect_bd_net [get_bd_pins rst_ps7_0_125M/peripheral_aresetn] \
  [get_bd_pins S00_ARESETN] [get_bd_pins ps7_0_axi_periph/S00_ARESETN] [get_bd_pins ps7_0_axi_periph/M00_ARESETN] \
  [get_bd_pins ps7_0_axi_periph/ARESETN] [get_bd_pins ps7_0_axi_periph/M01_ARESETN] \
  [get_bd_pins ps7_0_axi_periph/M02_ARESETN] [get_bd_pins ps7_0_axi_periph/M03_ARESETN] \
  [get_bd_pins ps7_0_axi_periph/M04_ARESETN] [get_bd_pins ps7_0_axi_periph/M05_ARESETN] \
  [get_bd_pins ps7_0_axi_periph/M06_ARESETN] [get_bd_pins ps7_0_axi_periph/M07_ARESETN] \
  [get_bd_pins ps7_0_axi_periph/M08_ARESETN]

current_bd_instance /ADC
connect_bd_intf_net [get_bd_intf_pins axis_red_pitaya_adc_0/M_AXIS] [get_bd_intf_pins signal_split_0/S_AXIS]
connect_bd_net [get_bd_pins adc_clk_n_i] [get_bd_pins axis_red_pitaya_adc_0/adc_clk_n]
connect_bd_net [get_bd_pins adc_clk_p_i] [get_bd_pins axis_red_pitaya_adc_0/adc_clk_p]
connect_bd_net [get_bd_pins adc_dat_a_i] [get_bd_pins axis_red_pitaya_adc_0/adc_dat_a]
connect_bd_net [get_bd_pins adc_dat_b_i] [get_bd_pins axis_red_pitaya_adc_0/adc_dat_b]
connect_bd_net [get_bd_pins axis_red_pitaya_adc_0/adc_clk] [get_bd_pins adc_clk]
connect_bd_net [get_bd_pins axis_red_pitaya_adc_0/adc_csn] [get_bd_pins adc_csn_o]
connect_bd_net [get_bd_pins signal_split_0/M_AXIS_PORT1_tdata] [get_bd_pins M_AXIS_PORT1_tdata]
connect_bd_net [get_bd_pins signal_split_0/M_AXIS_PORT1_tvalid] [get_bd_pins M_AXIS_PORT1_tvalid]
connect_bd_net [get_bd_pins signal_split_0/M_AXIS_PORT2_tdata] [get_bd_pins M_AXIS_PORT2_tdata]
connect_bd_net [get_bd_pins signal_split_0/M_AXIS_PORT2_tvalid] [get_bd_pins M_AXIS_PORT2_tvalid]

current_bd_instance /Procesamiento
connect_bd_net [get_bd_pins N_averaged_samples] [get_bd_pins promedio_lineal_0/N_averaged_samples] [get_bd_pins coherent_average_0/N_prom_lineal_in]
connect_bd_net [get_bd_pins N_ca_in] [get_bd_pins coherent_average_0/N_ca_in]
connect_bd_net -net axis_red_pitaya_adc_0_adc_clk [get_bd_pins clk] [get_bd_pins promedio_lineal_0/clk] [get_bd_pins coherent_average_0/clk]
connect_bd_net [get_bd_pins bram_porta_rddata] [get_bd_pins coherent_average_0/bram_porta_rddata]
connect_bd_net [get_bd_pins bram_portb_rddata] [get_bd_pins coherent_average_0/bram_portb_rddata]
connect_bd_net [get_bd_pins coherent_average_0/bram_index_addr] [get_bd_pins bram_index_addr]
connect_bd_net [get_bd_pins coherent_average_0/bram_index_clk] [get_bd_pins bram_index_clk]
connect_bd_net [get_bd_pins coherent_average_0/bram_index_data] [get_bd_pins bram_index_data]
connect_bd_net [get_bd_pins coherent_average_0/bram_index_enable] [get_bd_pins bram_index_enable]
connect_bd_net [get_bd_pins coherent_average_0/bram_porta_addr] [get_bd_pins bram_porta_addr]
connect_bd_net [get_bd_pins coherent_average_0/bram_porta_clk] [get_bd_pins bram_porta_clk]
connect_bd_net [get_bd_pins coherent_average_0/bram_porta_we] [get_bd_pins bram_porta_we]
connect_bd_net [get_bd_pins coherent_average_0/bram_porta_wrdata] [get_bd_pins bram_porta_wrdata]
connect_bd_net [get_bd_pins coherent_average_0/bram_portb_addr] [get_bd_pins bram_portb_addr]
connect_bd_net [get_bd_pins coherent_average_0/bram_portb_clk] [get_bd_pins bram_portb_clk]
connect_bd_net [get_bd_pins coherent_average_0/bram_portb_rst] [get_bd_pins bram_portb_rst]
connect_bd_net [get_bd_pins coherent_average_0/bram_portb_we] [get_bd_pins bram_portb_we]
connect_bd_net [get_bd_pins coherent_average_0/bram_portb_wrdata] [get_bd_pins bram_portb_wrdata]
connect_bd_net [get_bd_pins coherent_average_0/finished] [get_bd_pins led_o]
connect_bd_net [get_bd_pins data] [get_bd_pins promedio_lineal_0/data]
connect_bd_net [get_bd_pins data_valid] [get_bd_pins promedio_lineal_0/data_valid]
connect_bd_net [get_bd_pins log2_divisor] [get_bd_pins promedio_lineal_0/log2_divisor]
connect_bd_net [get_bd_pins promedio_lineal_0/data_out] [get_bd_pins data_out] [get_bd_pins coherent_average_0/data]
connect_bd_net [get_bd_pins promedio_lineal_0/data_out_valid] [get_bd_pins data_out_valid] [get_bd_pins coherent_average_0/data_valid]
connect_bd_net -net rst_Dout [get_bd_pins user_reset] [get_bd_pins coherent_average_0/user_reset]
connect_bd_net -net rst_ps7_0_125M_peripheral_aresetn [get_bd_pins reset_n] \
  [get_bd_pins promedio_lineal_0/reset_n] [get_bd_pins coherent_average_0/reset_n]
connect_bd_net [get_bd_pins trigger] [get_bd_pins coherent_average_0/trigger]

current_bd_instance /Procesamiento1
connect_bd_net [get_bd_pins N_averaged_samples] [get_bd_pins promedio_lineal_0/N_averaged_samples] [get_bd_pins coherent_average_0/N_prom_lineal_in]
connect_bd_net [get_bd_pins N_ca_in] [get_bd_pins coherent_average_0/N_ca_in]
connect_bd_net -net axis_red_pitaya_adc_0_adc_clk [get_bd_pins clk] [get_bd_pins promedio_lineal_0/clk] [get_bd_pins coherent_average_0/clk]
connect_bd_net [get_bd_pins bram_porta_rddata] [get_bd_pins coherent_average_0/bram_porta_rddata]
connect_bd_net [get_bd_pins bram_portb_rddata] [get_bd_pins coherent_average_0/bram_portb_rddata]
connect_bd_net [get_bd_pins coherent_average_0/bram_porta_addr] [get_bd_pins bram_porta_addr]
connect_bd_net [get_bd_pins coherent_average_0/bram_porta_clk] [get_bd_pins bram_porta_clk]
connect_bd_net [get_bd_pins coherent_average_0/bram_porta_we] [get_bd_pins bram_porta_we]
connect_bd_net [get_bd_pins coherent_average_0/bram_porta_wrdata] [get_bd_pins bram_porta_wrdata]
connect_bd_net [get_bd_pins coherent_average_0/bram_portb_addr] [get_bd_pins bram_portb_addr]
connect_bd_net [get_bd_pins coherent_average_0/bram_portb_clk] [get_bd_pins bram_portb_clk]
connect_bd_net [get_bd_pins coherent_average_0/bram_portb_rst] [get_bd_pins bram_portb_rst]
connect_bd_net [get_bd_pins coherent_average_0/bram_portb_we] [get_bd_pins bram_portb_we]
connect_bd_net [get_bd_pins coherent_average_0/bram_portb_wrdata] [get_bd_pins bram_portb_wrdata]
connect_bd_net [get_bd_pins coherent_average_0/finished] [get_bd_pins led_o]
connect_bd_net [get_bd_pins data] [get_bd_pins promedio_lineal_0/data]
connect_bd_net [get_bd_pins data_valid] [get_bd_pins promedio_lineal_0/data_valid]
connect_bd_net [get_bd_pins log2_divisor] [get_bd_pins promedio_lineal_0/log2_divisor]
connect_bd_net [get_bd_pins promedio_lineal_0/data_out] [get_bd_pins coherent_average_0/data]
connect_bd_net [get_bd_pins promedio_lineal_0/data_out_valid] [get_bd_pins coherent_average_0/data_valid]
connect_bd_net -net rst_Dout [get_bd_pins user_reset] [get_bd_pins coherent_average_0/user_reset]
connect_bd_net -net rst_ps7_0_125M_peripheral_aresetn [get_bd_pins reset_n] \
  [get_bd_pins promedio_lineal_0/reset_n] [get_bd_pins coherent_average_0/reset_n]
connect_bd_net [get_bd_pins trigger] [get_bd_pins coherent_average_0/trigger]

current_bd_instance /BRAM1
connect_bd_intf_net [get_bd_intf_pins S_AXI] [get_bd_intf_pins axi_bram_reader_1/S_AXI]
connect_bd_net [get_bd_pins axi_bram_reader_1/bram_porta_addr] [get_bd_pins bram_switch_0/bram_porta_addr]
connect_bd_net [get_bd_pins axi_bram_reader_1/bram_porta_clk] [get_bd_pins bram_switch_0/bram_porta_clk]
connect_bd_net [get_bd_pins axi_bram_reader_1/bram_porta_din] [get_bd_pins bram_switch_0/bram_porta_wrdata]
connect_bd_net [get_bd_pins axi_bram_reader_1/bram_porta_rst] [get_bd_pins bram_switch_0/bram_porta_rst]
connect_bd_net [get_bd_pins axi_bram_reader_1/bram_porta_we] [get_bd_pins bram_switch_0/bram_porta_we]
connect_bd_net [get_bd_pins blk_mem_gen_1/douta] [get_bd_pins douta]
connect_bd_net [get_bd_pins blk_mem_gen_1/doutb] [get_bd_pins bram_switch_0/bram_portc_rddata]
connect_bd_net [get_bd_pins bram_portb_addr] [get_bd_pins bram_switch_0/bram_portb_addr]
connect_bd_net [get_bd_pins bram_portb_clk] [get_bd_pins bram_switch_0/bram_portb_clk]
connect_bd_net [get_bd_pins bram_portb_rst] [get_bd_pins bram_switch_0/bram_portb_rst]
connect_bd_net [get_bd_pins bram_portb_we] [get_bd_pins bram_switch_0/bram_portb_we]
connect_bd_net [get_bd_pins bram_portb_wrdata] [get_bd_pins bram_switch_0/bram_portb_wrdata]
connect_bd_net [get_bd_pins bram_switch_0/bram_porta_rddata] [get_bd_pins axi_bram_reader_1/bram_porta_dout]
connect_bd_net [get_bd_pins bram_switch_0/bram_portb_rddata] [get_bd_pins bram_portb_rddata]
connect_bd_net [get_bd_pins bram_switch_0/bram_portc_addr] [get_bd_pins blk_mem_gen_1/addrb]
connect_bd_net [get_bd_pins bram_switch_0/bram_portc_clk] [get_bd_pins blk_mem_gen_1/clkb]
connect_bd_net [get_bd_pins bram_switch_0/bram_portc_we] [get_bd_pins blk_mem_gen_1/web]
connect_bd_net [get_bd_pins bram_switch_0/bram_portc_wrdata] [get_bd_pins blk_mem_gen_1/dinb]
connect_bd_net -net coherent_average_0_bram_porta_addr [get_bd_pins addra] [get_bd_pins blk_mem_gen_1/addra]
connect_bd_net -net coherent_average_0_bram_porta_clk [get_bd_pins clka] [get_bd_pins blk_mem_gen_1/clka]
connect_bd_net -net coherent_average_0_bram_porta_we [get_bd_pins wea] [get_bd_pins blk_mem_gen_1/wea] [get_bd_pins blk_mem_gen_1/ena]
connect_bd_net -net coherent_average_0_bram_porta_wrdata [get_bd_pins dina] [get_bd_pins blk_mem_gen_1/dina]
connect_bd_net [get_bd_pins led_o] [get_bd_pins bram_switch_0/switch]
connect_bd_net -net processing_system7_0_FCLK_CLK0 [get_bd_pins s00_axi_aclk] [get_bd_pins axi_bram_reader_1/s00_axi_aclk]
connect_bd_net [get_bd_pins s00_axi_aresetn] [get_bd_pins axi_bram_reader_1/s00_axi_aresetn]

current_bd_instance /BRAM2
connect_bd_intf_net [get_bd_intf_pins S_AXI] [get_bd_intf_pins axi_bram_reader_1/S_AXI]
connect_bd_net [get_bd_pins addra] [get_bd_pins blk_mem_gen_1/addra]
connect_bd_net [get_bd_pins axi_bram_reader_1/bram_porta_addr] [get_bd_pins bram_switch_0/bram_porta_addr]
connect_bd_net [get_bd_pins axi_bram_reader_1/bram_porta_clk] [get_bd_pins bram_switch_0/bram_porta_clk]
connect_bd_net [get_bd_pins axi_bram_reader_1/bram_porta_din] [get_bd_pins bram_switch_0/bram_porta_wrdata]
connect_bd_net [get_bd_pins axi_bram_reader_1/bram_porta_rst] [get_bd_pins bram_switch_0/bram_porta_rst]
connect_bd_net [get_bd_pins axi_bram_reader_1/bram_porta_we] [get_bd_pins bram_switch_0/bram_porta_we]
connect_bd_net [get_bd_pins blk_mem_gen_1/douta] [get_bd_pins douta]
connect_bd_net [get_bd_pins blk_mem_gen_1/doutb] [get_bd_pins bram_switch_0/bram_portc_rddata]
connect_bd_net [get_bd_pins bram_portb_addr] [get_bd_pins bram_switch_0/bram_portb_addr]
connect_bd_net [get_bd_pins bram_portb_clk] [get_bd_pins bram_switch_0/bram_portb_clk]
connect_bd_net [get_bd_pins bram_portb_rst] [get_bd_pins bram_switch_0/bram_portb_rst]
connect_bd_net [get_bd_pins bram_portb_we] [get_bd_pins bram_switch_0/bram_portb_we]
connect_bd_net [get_bd_pins bram_portb_wrdata] [get_bd_pins bram_switch_0/bram_portb_wrdata]
connect_bd_net [get_bd_pins bram_switch_0/bram_porta_rddata] [get_bd_pins axi_bram_reader_1/bram_porta_dout]
connect_bd_net [get_bd_pins bram_switch_0/bram_portb_rddata] [get_bd_pins bram_portb_rddata]
connect_bd_net [get_bd_pins bram_switch_0/bram_portc_addr] [get_bd_pins blk_mem_gen_1/addrb]
connect_bd_net [get_bd_pins bram_switch_0/bram_portc_clk] [get_bd_pins blk_mem_gen_1/clkb]
connect_bd_net [get_bd_pins bram_switch_0/bram_portc_we] [get_bd_pins blk_mem_gen_1/web]
connect_bd_net [get_bd_pins bram_switch_0/bram_portc_wrdata] [get_bd_pins blk_mem_gen_1/dinb]
connect_bd_net [get_bd_pins clka] [get_bd_pins blk_mem_gen_1/clka]
connect_bd_net [get_bd_pins dina] [get_bd_pins blk_mem_gen_1/dina]
connect_bd_net [get_bd_pins led_o] [get_bd_pins bram_switch_0/switch]
connect_bd_net -net processing_system7_0_FCLK_CLK0 [get_bd_pins s00_axi_aclk] [get_bd_pins axi_bram_reader_1/s00_axi_aclk]
connect_bd_net [get_bd_pins s00_axi_aresetn] [get_bd_pins axi_bram_reader_1/s00_axi_aresetn]
connect_bd_net [get_bd_pins wea] [get_bd_pins blk_mem_gen_1/ena] [get_bd_pins blk_mem_gen_1/wea]

current_bd_instance /trigger_indexes_mem
connect_bd_intf_net [get_bd_intf_pins finish_indexes/BRAM_PORTB] [get_bd_intf_pins axi_bram_reader_0/BRAM_PORTA]
connect_bd_intf_net -intf_net uP_M08_AXI [get_bd_intf_pins S_AXI] [get_bd_intf_pins axi_bram_reader_0/S_AXI]
connect_bd_net -net Procesamiento_bram_index_addr [get_bd_pins addra] [get_bd_pins finish_indexes/addra]
connect_bd_net -net Procesamiento_bram_index_clk [get_bd_pins clka] [get_bd_pins finish_indexes/clka]
connect_bd_net -net Procesamiento_bram_index_data [get_bd_pins dina] [get_bd_pins finish_indexes/dina]
connect_bd_net -net Procesamiento_bram_index_enable [get_bd_pins wea] [get_bd_pins finish_indexes/wea] [get_bd_pins finish_indexes/ena]
connect_bd_net -net processing_system7_0_FCLK_CLK0 [get_bd_pins s00_axi_aclk] [get_bd_pins axi_bram_reader_0/s00_axi_aclk]
connect_bd_net -net rst_ps7_0_125M_peripheral_aresetn [get_bd_pins s00_axi_aresetn] [get_bd_pins axi_bram_reader_0/s00_axi_aresetn]

current_bd_instance /
connect_bd_intf_net [get_bd_intf_pins BRAM1/S_AXI] [get_bd_intf_pins uP/M06_AXI]
connect_bd_intf_net -intf_net processing_system7_0_DDR [get_bd_intf_ports DDR] [get_bd_intf_pins uP/DDR]
connect_bd_intf_net -intf_net processing_system7_0_FIXED_IO [get_bd_intf_ports FIXED_IO] [get_bd_intf_pins uP/FIXED_IO]
connect_bd_intf_net [get_bd_intf_pins uP/M01_AXI] [get_bd_intf_pins uP_control/S_AXI]
connect_bd_intf_net [get_bd_intf_pins uP/M02_AXI] [get_bd_intf_pins uP_control/S_AXI2]
connect_bd_intf_net [get_bd_intf_pins uP/M03_AXI] [get_bd_intf_pins uP_control/S_AXI1]
connect_bd_intf_net [get_bd_intf_pins uP/M00_AXI] [get_bd_intf_pins BRAM2/S_AXI]
connect_bd_intf_net [get_bd_intf_pins uP/M04_AXI] [get_bd_intf_pins uP_control/S_AXI3]
connect_bd_intf_net [get_bd_intf_pins uP/M05_AXI] [get_bd_intf_pins uP_control/S_AXI4]
connect_bd_intf_net [get_bd_intf_pins uP/M07_AXI] [get_bd_intf_pins uP_control/S_AXI5]
connect_bd_intf_net [get_bd_intf_pins trigger_indexes_mem/S_AXI] [get_bd_intf_pins uP/M08_AXI]
connect_bd_net [get_bd_pins ADC/M_AXIS_PORT1_tdata] [get_bd_pins Procesamiento/data] [get_bd_pins level_detector_0/data_in_1]
connect_bd_net [get_bd_pins ADC/M_AXIS_PORT1_tvalid] [get_bd_pins Procesamiento/data_valid] [get_bd_pins level_detector_0/data_in_1_valid]
connect_bd_net [get_bd_pins ADC/adc_csn_o] [get_bd_ports adc_csn_o]
connect_bd_net [get_bd_pins BRAM1/bram_portb_rddata] [get_bd_pins Procesamiento1/bram_portb_rddata]
connect_bd_net -net N_averaged_samples_1 [get_bd_pins uP_control/Dout3] \
  [get_bd_pins Procesamiento1/N_averaged_samples] [get_bd_pins Procesamiento/N_averaged_samples] \
  [get_bd_pins trigger_simulator_0/K_sobremuestreo_in]
connect_bd_net [get_bd_ports exp_p_tri_io] [get_bd_pins drive_gpios_1/signal_export]
connect_bd_net [get_bd_pins uP_control/gpio_io_o] [get_bd_pins DAC/cfg_data]
connect_bd_net [get_bd_ports exp_n_tri_io] [get_bd_pins drive_gpios_0/signal_export]
connect_bd_net [get_bd_pins Procesamiento1/bram_porta_clk] [get_bd_pins BRAM1/clka]
connect_bd_net [get_bd_pins Procesamiento1/bram_portb_addr] [get_bd_pins BRAM1/bram_portb_addr]
connect_bd_net [get_bd_pins Procesamiento1/bram_portb_clk] [get_bd_pins BRAM1/bram_portb_clk]
connect_bd_net [get_bd_pins Procesamiento1/bram_portb_rst] [get_bd_pins BRAM1/bram_portb_rst]
connect_bd_net [get_bd_pins Procesamiento1/bram_portb_we] [get_bd_pins BRAM1/bram_portb_we]
connect_bd_net [get_bd_pins Procesamiento1/bram_portb_wrdata] [get_bd_pins BRAM1/bram_portb_wrdata]
connect_bd_net [get_bd_pins Procesamiento/bram_index_addr] [get_bd_pins trigger_indexes_mem/addra]
connect_bd_net [get_bd_pins Procesamiento/bram_index_clk] [get_bd_pins trigger_indexes_mem/clka]
connect_bd_net [get_bd_pins Procesamiento/bram_index_data] [get_bd_pins trigger_indexes_mem/dina]
connect_bd_net [get_bd_pins Procesamiento/bram_index_enable] [get_bd_pins trigger_indexes_mem/wea]
connect_bd_net [get_bd_pins Procesamiento/data_out] [get_bd_pins trigger_simulator_0/data_in]
connect_bd_net [get_bd_pins Procesamiento/data_out_valid] [get_bd_pins trigger_simulator_0/data_valid]
connect_bd_net [get_bd_pins Procesamiento/led_o] [get_bd_pins uP_control/led_o] [get_bd_pins BRAM2/led_o]
connect_bd_net [get_bd_ports adc_clk_n_i] [get_bd_pins ADC/adc_clk_n_i]
connect_bd_net [get_bd_ports adc_clk_p_i] [get_bd_pins ADC/adc_clk_p_i]
connect_bd_net [get_bd_ports adc_dat_a_i] [get_bd_pins ADC/adc_dat_a_i]
connect_bd_net [get_bd_ports adc_dat_b_i] [get_bd_pins ADC/adc_dat_b_i]
connect_bd_net -net addra_1 [get_bd_pins Procesamiento/bram_porta_addr] [get_bd_pins BRAM2/addra]
connect_bd_net -net addra_2 [get_bd_pins Procesamiento1/bram_porta_addr] [get_bd_pins BRAM1/addra]
connect_bd_net -net axis_red_pitaya_adc_0_adc_clk [get_bd_pins ADC/adc_clk] \
  [get_bd_pins DAC/aclk] [get_bd_pins Procesamiento/clk] [get_bd_pins Procesamiento1/clk] \
  [get_bd_pins trigger_simulator_0/clk] [get_bd_pins level_detector_0/clk]
connect_bd_net -net axis_red_pitaya_dac_0_dac_clk [get_bd_pins DAC/dac_clk_o] [get_bd_ports dac_clk_o]
connect_bd_net -net axis_red_pitaya_dac_0_dac_dat [get_bd_pins DAC/dac_dat_o] [get_bd_ports dac_dat_o]
connect_bd_net -net axis_red_pitaya_dac_0_dac_rst [get_bd_pins DAC/dac_rst_o] [get_bd_ports dac_rst_o]
connect_bd_net -net axis_red_pitaya_dac_0_dac_sel [get_bd_pins DAC/dac_sel_o] [get_bd_ports dac_sel_o]
connect_bd_net -net axis_red_pitaya_dac_0_dac_wrt [get_bd_pins DAC/dac_wrt_o] [get_bd_ports dac_wrt_o]
connect_bd_net -net bram_porta_rddata_1 [get_bd_pins BRAM1/douta] [get_bd_pins Procesamiento1/bram_porta_rddata]
connect_bd_net -net bram_porta_rddata_2 [get_bd_pins BRAM2/douta] [get_bd_pins Procesamiento/bram_porta_rddata]
connect_bd_net -net bram_portb_addr_1 [get_bd_pins Procesamiento/bram_portb_addr] [get_bd_pins BRAM2/bram_portb_addr]
connect_bd_net -net bram_portb_clk_1 [get_bd_pins Procesamiento/bram_portb_clk] [get_bd_pins BRAM2/bram_portb_clk]
connect_bd_net -net bram_portb_rddata_1 [get_bd_pins BRAM2/bram_portb_rddata] [get_bd_pins Procesamiento/bram_portb_rddata]
connect_bd_net -net bram_portb_rst_1 [get_bd_pins Procesamiento/bram_portb_rst] [get_bd_pins BRAM2/bram_portb_rst]
connect_bd_net -net bram_portb_we_1 [get_bd_pins Procesamiento/bram_portb_we] [get_bd_pins BRAM2/bram_portb_we]
connect_bd_net -net bram_portb_wrdata_1 [get_bd_pins Procesamiento/bram_portb_wrdata] [get_bd_pins BRAM2/bram_portb_wrdata]
connect_bd_net -net clka_1 [get_bd_pins Procesamiento/bram_porta_clk] [get_bd_pins BRAM2/clka]
connect_bd_net [get_bd_ports daisy_n_i] [get_bd_pins util_ds_buf_1/IBUF_DS_N]
connect_bd_net [get_bd_ports daisy_p_i] [get_bd_pins util_ds_buf_1/IBUF_DS_P]
connect_bd_net -net data_1 [get_bd_pins ADC/M_AXIS_PORT2_tdata] [get_bd_pins Procesamiento1/data] [get_bd_pins level_detector_0/data_in_2]
connect_bd_net -net data_valid_1 [get_bd_pins ADC/M_AXIS_PORT2_tvalid] \
  [get_bd_pins Procesamiento1/data_valid] [get_bd_pins level_detector_0/data_in_2_valid]
connect_bd_net -net dina_1 [get_bd_pins Procesamiento/bram_porta_wrdata] [get_bd_pins BRAM2/dina]
connect_bd_net -net dina_2 [get_bd_pins Procesamiento1/bram_porta_wrdata] [get_bd_pins BRAM1/dina]
connect_bd_net [get_bd_pins drive_gpios_0/output_0] [get_bd_pins trigger_simulator_0/trig_externo]
connect_bd_net [get_bd_pins drive_leds_0/signal_out] [get_bd_ports led_o]
connect_bd_net -net led_o_1 [get_bd_pins Procesamiento1/led_o] [get_bd_pins BRAM1/led_o]
connect_bd_net [get_bd_pins level_detector_0/level_detected_0] [get_bd_pins drive_gpios_1/input_0] [get_bd_pins drive_leds_0/signal_0]
connect_bd_net [get_bd_pins level_detector_0/level_detected_1] [get_bd_pins drive_gpios_1/input_1] [get_bd_pins drive_leds_0/signal_1]
connect_bd_net -net log2_divisor_1 [get_bd_pins uP_control/Dout7] \
  [get_bd_pins Procesamiento/log2_divisor] [get_bd_pins Procesamiento1/log2_divisor] \
  [get_bd_pins trigger_simulator_0/log2_div_in]
connect_bd_net -net processing_system7_0_FCLK_CLK0 [get_bd_pins uP/FCLK_CLK0] \
  [get_bd_pins uP_control/s_axi_aclk] [get_bd_pins BRAM1/s00_axi_aclk] [get_bd_pins BRAM2/s00_axi_aclk] \
  [get_bd_pins trigger_indexes_mem/s00_axi_aclk]
connect_bd_net -net rst_Dout [get_bd_pins uP_control/Dout1] \
  [get_bd_pins Procesamiento/user_reset] [get_bd_pins Procesamiento1/user_reset] [get_bd_pins trigger_simulator_0/user_reset]
connect_bd_net -net rst_ps7_0_125M_peripheral_aresetn [get_bd_pins uP/S00_ARESETN] \
  [get_bd_pins uP_control/s_axi_aresetn] [get_bd_pins Procesamiento/reset_n] [get_bd_pins Procesamiento1/reset_n] \
  [get_bd_pins BRAM1/s00_axi_aresetn] [get_bd_pins BRAM2/s00_axi_aresetn] [get_bd_pins trigger_simulator_0/reset_n] \
  [get_bd_pins trigger_indexes_mem/s00_axi_aresetn] [get_bd_pins level_detector_0/reset_n]
connect_bd_net [get_bd_pins trigger_simulator_0/trig_cont_export] [get_bd_pins drive_gpios_0/input_0]
connect_bd_net -net trigger_simulator_1_trig [get_bd_pins trigger_simulator_0/trig] \
  [get_bd_pins Procesamiento/trigger] [get_bd_pins Procesamiento1/trigger] [get_bd_pins drive_leds_0/signal_2] \
  [get_bd_pins drive_gpios_0/input_1]
connect_bd_net [get_bd_pins uP_control/Dout] [get_bd_pins Procesamiento/N_ca_in] [get_bd_pins Procesamiento1/N_ca_in]
connect_bd_net [get_bd_pins uP_control/Dout2] [get_bd_pins Procesamiento/enable] [get_bd_pins Procesamiento1/enable]
connect_bd_net [get_bd_pins uP_control/Dout4] [get_bd_pins trigger_simulator_0/M_in]
connect_bd_net [get_bd_pins uP_control/Dout5] [get_bd_pins trigger_simulator_0/trigger_mode_in]
connect_bd_net [get_bd_pins uP_control/Dout6] [get_bd_pins trigger_simulator_0/trigger_level_in]
connect_bd_net [get_bd_pins uP_control/gpio_io_o1] [get_bd_pins level_detector_0/level_to_detect]
connect_bd_net [get_bd_pins util_ds_buf_1/IBUF_OUT] [get_bd_pins util_ds_buf_2/OBUF_IN]
connect_bd_net [get_bd_pins util_ds_buf_2/OBUF_DS_N] [get_bd_ports daisy_n_o]
connect_bd_net [get_bd_pins util_ds_buf_2/OBUF_DS_P] [get_bd_ports daisy_p_o]
connect_bd_net -net wea_1 [get_bd_pins Procesamiento/bram_porta_we] [get_bd_pins BRAM2/wea]
connect_bd_net -net wea_2 [get_bd_pins Procesamiento1/bram_porta_we] [get_bd_pins BRAM1/wea]

# ---- address map ----
assign_bd_address -offset 0x40000000 -range 256K -target_address_space [get_bd_addr_spaces uP/processing_system7_0/Data] [get_bd_addr_segs BRAM2/axi_bram_reader_1/s00_axi/reg0]
assign_bd_address -offset 0x40040000 -range 256K -target_address_space [get_bd_addr_spaces uP/processing_system7_0/Data] [get_bd_addr_segs BRAM1/axi_bram_reader_1/s00_axi/reg0]
assign_bd_address -offset 0x40080000 -range 32K -target_address_space [get_bd_addr_spaces uP/processing_system7_0/Data] [get_bd_addr_segs trigger_indexes_mem/axi_bram_reader_0/s00_axi/reg0]
assign_bd_address -offset 0x41200000 -range 64K -target_address_space [get_bd_addr_spaces uP/processing_system7_0/Data] [get_bd_addr_segs uP_control/Control_and_Nca/S_AXI/Reg]
assign_bd_address -offset 0x41210000 -range 64K -target_address_space [get_bd_addr_spaces uP/processing_system7_0/Data] [get_bd_addr_segs uP_control/finish/S_AXI/Reg]
assign_bd_address -offset 0x41220000 -range 64K -target_address_space [get_bd_addr_spaces uP/processing_system7_0/Data] [get_bd_addr_segs uP_control/DAC_and_M/S_AXI/Reg]
assign_bd_address -offset 0x41230000 -range 64K -target_address_space [get_bd_addr_spaces uP/processing_system7_0/Data] [get_bd_addr_segs uP_control/K_and_log2div/S_AXI/Reg]
assign_bd_address -offset 0x41240000 -range 64K -target_address_space [get_bd_addr_spaces uP/processing_system7_0/Data] [get_bd_addr_segs uP_control/Trigger/S_AXI/Reg]
assign_bd_address -offset 0x41250000 -range 64K -target_address_space [get_bd_addr_spaces uP/processing_system7_0/Data] [get_bd_addr_segs uP_control/Level_detect/S_AXI/Reg]

validate_bd_design
save_bd_design
